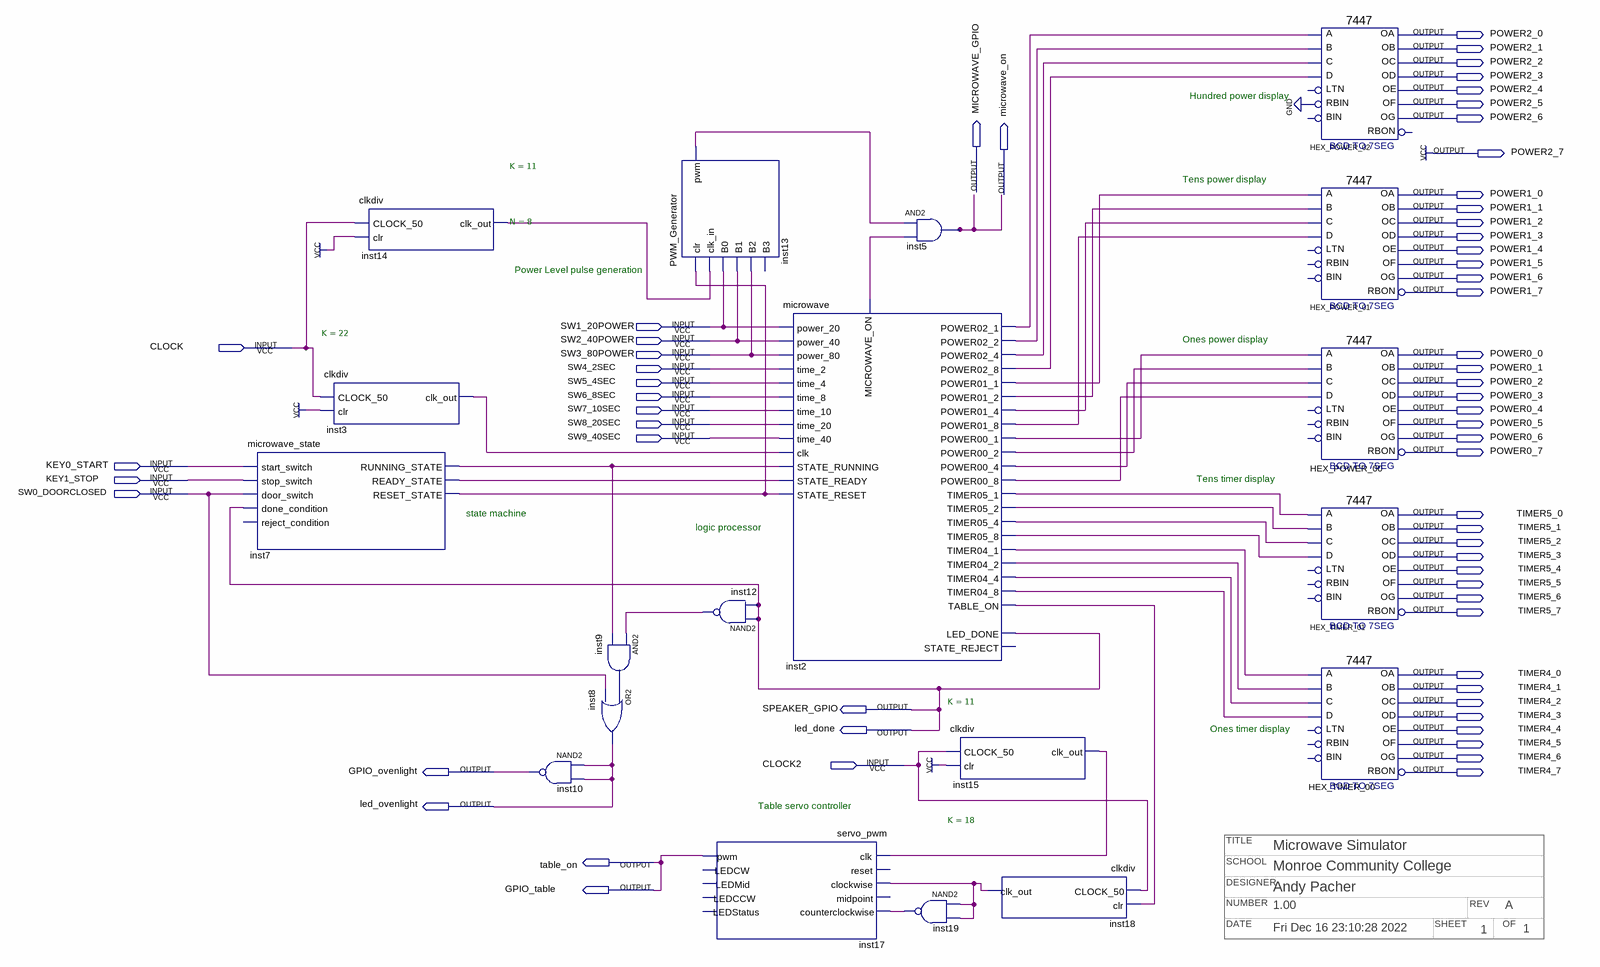
[diagram p0: schematic sheet]
// Quartus schematic Microwave_Simulator.bdf as structural Verilog: 19 symbols, 62 pins
// Title block: DATE: Fri Dec 16 23:10:28 2022; DESIGNER: Andy Pacher; NUMBER: 1.00; OF: 1; REV: A; SCHOOL: Monroe Community College; SHEET: 1; TITLE: Microwave Simulator
module Microwave_Simulator (
  input  SW1_20POWER,
  input  SW2_40POWER,
  input  CLOCK,
  input  SW3_80POWER,
  input  SW4_2SEC,
  input  SW5_4SEC,
  input  SW6_8SEC,
  input  SW7_10SEC,
  input  SW8_20SEC,
  input  SW9_40SEC,
  input  KEY0_START,
  input  KEY1_STOP,
  input  SW0_DOORCLOSED,
  input  CLOCK2,
  output POWER2_0,
  output POWER2_1,
  output POWER2_2,
  output POWER2_3,
  output POWER2_4,
  output POWER2_5,
  output POWER2_6,
  output POWER2_7,
  output MICROWAVE_GPIO,
  output microwave_on,
  output POWER1_0,
  output POWER1_1,
  output POWER1_2,
  output POWER1_3,
  output POWER1_4,
  output POWER1_5,
  output POWER1_6,
  output POWER1_7,
  output POWER0_0,
  output POWER0_1,
  output POWER0_2,
  output POWER0_3,
  output POWER0_4,
  output POWER0_5,
  output POWER0_6,
  output POWER0_7,
  output TIMER5_0,
  output TIMER5_1,
  output TIMER5_2,
  output TIMER5_3,
  output TIMER5_4,
  output TIMER5_5,
  output TIMER5_6,
  output TIMER5_7,
  output TIMER4_0,
  output TIMER4_1,
  output TIMER4_2,
  output SPEAKER_GPIO,
  output TIMER4_3,
  output led_done,
  output TIMER4_4,
  output TIMER4_5,
  output TIMER4_6,
  output GPIO_ovenlight,
  output TIMER4_7,
  output led_ovenlight,
  output table_on,
  output GPIO_table
);

  wire inst2_microwave_on, inst2_power00_1, inst2_power00_2, inst2_power00_4, inst2_power00_8,
       inst2_power01_1, inst2_power01_2, inst2_power01_4, inst2_power01_8, inst2_power02_1, inst2_power02_2,
       inst2_power02_4, inst2_power02_8, inst2_table_on, inst2_timer04_1, inst2_timer04_2, inst2_timer04_4,
       inst2_timer04_8, inst2_timer05_1, inst2_timer05_2, inst2_timer05_4, inst2_timer05_8, inst3_clk_out,
       inst5_out, inst7_ready_state, inst7_reset_state, inst7_running_state, inst9_out, inst12_out,
       inst13_pwm, inst14_clk_out, inst15_clk_out, inst18_clk_out, inst19_out;

  microwave_state inst7 (
    .start_switch(KEY0_START), .stop_switch(KEY1_STOP), .door_switch(SW0_DOORCLOSED),
    .done_condition(led_done), .RUNNING_STATE(inst7_running_state), .READY_STATE(inst7_ready_state),
    .RESET_STATE(inst7_reset_state));  // open: reject_condition
  clkdiv #(.K(22)) inst3 (.CLOCK_50(CLOCK), .clr(1'b1), .clk_out(inst3_clk_out));
  clkdiv #(.K(11)) inst14 (.CLOCK_50(CLOCK), .clr(1'b1), .clk_out(inst14_clk_out));
  nand inst10 (GPIO_ovenlight, led_ovenlight, led_ovenlight);
  and inst9 (inst9_out, inst12_out, inst7_running_state);
  or inst8 (led_ovenlight, inst9_out, SW0_DOORCLOSED);
  PWM_Generator #(.N(8)) inst13 (
    .clr(inst7_reset_state), .clk_in(inst14_clk_out), .B0(SW1_20POWER), .B1(SW2_40POWER), .B2(SW3_80POWER),
    .pwm(inst13_pwm));  // open: B3
  nand inst12 (inst12_out, led_done, led_done);
  servo_pwm inst17 (
    .clk(inst15_clk_out), .clockwise(inst18_clk_out), .counterclockwise(inst19_out), .pwm(GPIO_table));  // open: reset, midpoint, LEDCW, LEDMid, LEDCCW, LEDStatus
  microwave inst2 (
    .power_20(SW1_20POWER), .power_40(SW2_40POWER), .power_80(SW3_80POWER), .time_2(SW4_2SEC),
    .time_4(SW5_4SEC), .time_8(SW6_8SEC), .time_10(SW7_10SEC), .time_20(SW8_20SEC), .time_40(SW9_40SEC),
    .clk(inst3_clk_out), .STATE_RUNNING(inst7_running_state), .STATE_READY(inst7_ready_state),
    .STATE_RESET(inst7_reset_state), .POWER02_1(inst2_power02_1), .POWER02_2(inst2_power02_2),
    .POWER02_4(inst2_power02_4), .POWER02_8(inst2_power02_8), .POWER01_1(inst2_power01_1),
    .POWER01_2(inst2_power01_2), .POWER01_4(inst2_power01_4), .POWER01_8(inst2_power01_8),
    .POWER00_1(inst2_power00_1), .POWER00_2(inst2_power00_2), .POWER00_4(inst2_power00_4),
    .POWER00_8(inst2_power00_8), .TIMER05_1(inst2_timer05_1), .TIMER05_2(inst2_timer05_2),
    .TIMER05_4(inst2_timer05_4), .TIMER05_8(inst2_timer05_8), .TIMER04_1(inst2_timer04_1),
    .TIMER04_2(inst2_timer04_2), .TIMER04_4(inst2_timer04_4), .TIMER04_8(inst2_timer04_8),
    .TABLE_ON(inst2_table_on), .MICROWAVE_ON(inst2_microwave_on), .LED_DONE(led_done));  // open: STATE_REJECT
  and inst5 (inst5_out, inst13_pwm, inst2_microwave_on);
  clkdiv #(.K(11)) inst15 (.CLOCK_50(CLOCK2), .clr(1'b1), .clk_out(inst15_clk_out));
  nand inst19 (inst19_out, inst18_clk_out, inst18_clk_out);
  clkdiv #(.K(18)) inst18 (.CLOCK_50(CLOCK2), .clr(inst2_table_on), .clk_out(inst18_clk_out));
  \7447  HEX_POWER_02 (
    .B(inst2_power02_2), .C(inst2_power02_4), .D(inst2_power02_8), .RBIN(1'b0), .A(inst2_power02_1),
    .OB(POWER2_1), .OC(POWER2_2), .OE(POWER2_4), .OD(POWER2_3), .OF(POWER2_5), .OG(POWER2_6), .OA(POWER2_0));  // open: LTN, BIN, RBON
  \7447  HEX_POWER_01 (
    .B(inst2_power01_2), .C(inst2_power01_4), .D(inst2_power01_8), .A(inst2_power01_1), .OB(POWER1_1),
    .OC(POWER1_2), .OE(POWER1_4), .OD(POWER1_3), .OF(POWER1_5), .OG(POWER1_6), .OA(POWER1_0), .RBON(POWER1_7));  // open: LTN, RBIN, BIN
  \7447  HEX_POWER_00 (
    .B(inst2_power00_2), .C(inst2_power00_4), .D(inst2_power00_8), .A(inst2_power00_1), .OB(POWER0_1),
    .OC(POWER0_2), .OE(POWER0_4), .OD(POWER0_3), .OF(POWER0_5), .OG(POWER0_6), .OA(POWER0_0), .RBON(POWER0_7));  // open: LTN, RBIN, BIN
  \7447  HEX_TIMER_01 (
    .B(inst2_timer05_2), .C(inst2_timer05_4), .D(inst2_timer05_8), .A(inst2_timer05_1), .OB(TIMER5_1),
    .OC(TIMER5_2), .OE(TIMER5_4), .OD(TIMER5_3), .OF(TIMER5_5), .OG(TIMER5_6), .OA(TIMER5_0), .RBON(TIMER5_7));  // open: LTN, RBIN, BIN
  \7447  HEX_TIMER_00 (
    .B(inst2_timer04_2), .C(inst2_timer04_4), .D(inst2_timer04_8), .A(inst2_timer04_1), .OB(TIMER4_1),
    .OC(TIMER4_2), .OE(TIMER4_4), .OD(TIMER4_3), .OF(TIMER4_5), .OG(TIMER4_6), .OA(TIMER4_0), .RBON(TIMER4_7));  // open: LTN, RBIN, BIN

  assign POWER2_7 = 1'b1;
  assign SPEAKER_GPIO = led_done;
  assign table_on = GPIO_table;

  // Notes on the sheet:
  //   Hundred power display
  //   Tens power display
  //   Power Level pulse generation
  //   Ones power display
  //   Tens timer display
  //   state machine
  //   logic processor
  //   Ones timer display
  //   Table servo controller
endmodule
